# EAGLE design br-BM05B (EAGLE 9.4.2)
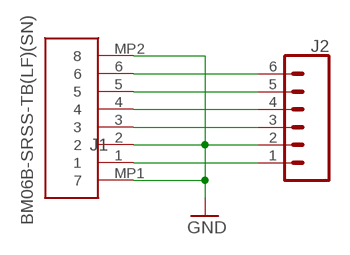
[diagram p0: schematic, sheet 1]

## Parts
J1  BM06B-SRSS-TB(LF)(SN)  [BM06BSRSSTBLFSN]
J2  CONN_06NO_SILK_FEMALE_PTH  [1X06_NO_SILK]

## Nets
GND: J1.2 J1.MP1 J1.MP2 J2.2
N$1: J1.1 J2.1
N$3: J1.3 J2.3
N$4: J1.4 J2.4
N$5: J1.5 J2.5
N$6: J1.6 J2.6

## Library data of the parts
J1 = 0SoK:BM06B-SRSS-TB(LF)(SN): connector,multipole PCB use,BM06B-SRSS-T JST SH Series, 1mm Pitch 6 Way 1 Row Straight PCB Header, Solder Termination, 1A Source: Datasheet <http://docs-emea.rs-online.com/webdocs/13ce/0900766b813ce45e.pdf>; DESCRIPTION: connector,multipole PCB use,BM06B-SRSS-T JST SH Series, 1mm Pitch 6 Way 1 Row Straight PCB Header, Solder Termination, 1A; HEIGHT: 4.25mm; MANUFACTURER_NAME: JST (JAPAN SOLDERLESS TERMINALS); MANUFACTURER_PART_NUMBER: BM06B-SRSS-TB(LF)(SN); RS_PART_NUMBER: 5468782; RS_PRICE-STOCK: https://uk.rs-online.com/web/p/products/5468782
J2 = SparkFun-Connectors:CONN_06: Multi connection point. Often used as Generic Header-pin footprint for 0.1 inch spaced/style header connections On any of the 0.1 inch spaced packages, you can populate with these: Break Away Headers - Straight <https://www.sparkfun.com/products/116> (PRT-00116) Break Away Male Headers - Right Angle <https://www.sparkfun.com/products/553> (PRT-00553) Female Headers <https://www.sparkfun.com/products/115> (PRT-00115) Break Away Headers - Machine Pin <https://www.sparkfun.com/products/117> (PRT-00117) Break Away Female Headers - Swiss Machine Pin <https://www.sparkfun.com/products/743> (PRT-00743) Arduino Stackable Header - 6 Pin <https://www.sparkfun.com/products/9280> (PRT-09280) For SCREWTERMINALS and SPRING TERMINALS visit here: Screw Terimnals on SparkFun.com <https://www.sparkfun.com/search/results?term=Screw+Terminals> (5mm/3.5mm/2.54mm spacing) This device is also useful as a general connection point to wire up your design to another part of your project. Our various solder wires solder well into these plated through hole pads. Hook-Up Wire - Assortment (Stranded, 22 AWG) <https://www.sparkfun.com/products/11375> (PRT-11375) Hook-Up Wire - Assortment (Solid Core, 22 AWG) <https://www.sparkfun.com/products/11367> (PRT-11367) View the entire wire category on our website here <https://www.sparkfun.com/categories/141>; PROD_ID: CONN-08437

## Board
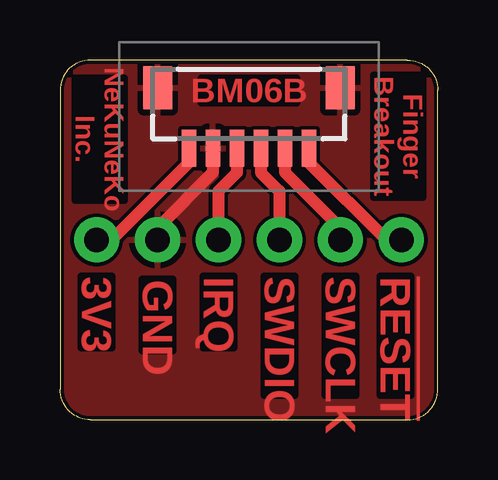
[diagram p1: board, top side]
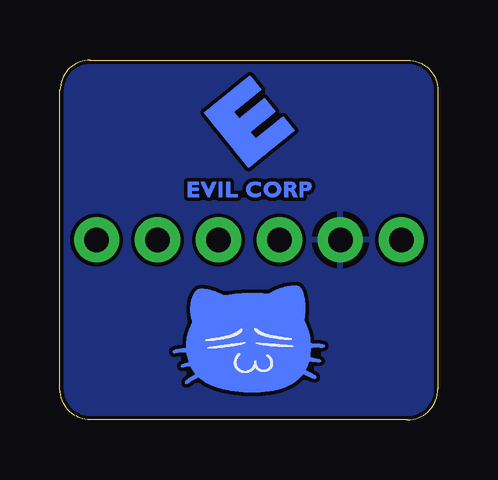
[diagram p2: board, bottom side, seen from below]

Size 15.75 x 14.99 mm. Coordinates in mm from the lower left corner, seen from the top.
Outline: 1.27,0 14.48,0 arc90 15.75,1.27 15.75,13.72 arc90 14.48,14.99 1.27,14.99 arc90 0,13.72 0,1.27 arc90 1.27,0
Copper layers (1*16): Top 0.035559375mm / dielectric 1.6mm / Bottom 0.035559375mm
Design rules "nekuneko": minimum track width 6mil, minimum drill 0.3mm, track to track 6mil, track to pad 6mil, pad to pad 6mil, via to via 6mil, smd to smd 6mil, copper to edge 6mil, drill to drill 6mil, minimum pad ring 5mil, minimum via ring 5mil, stop-mask expansion 2.5mil, vias tented up to drill 0mil, thermal gap 10mil

### Footprints (pad centres in the part's own frame; a part is rotated, then mirrored left to right if it is on the bottom)
BM06BSRSSTBLFSN = smd 0.6 x 1.55: 1 -2.5,-1.65; 2 -1.5,-1.65; 3 -0.5,-1.65; 4 0.5,-1.65; 5 1.5,-1.65; 6 2.5,-1.65 | smd 1.2 x 1.8: MP1 -3.8,0.875; MP2 3.8,0.875
1X06_NO_SILK = drill 1.016 pad 1.88: 1 0,0; 2 2.54,0; 3 5.08,0; 4 7.62,0; 5 10.16,0; 6 12.7,0

### Placement (x,y rotation side)
J1  7.87,12.95 0 top
J2  1.52,7.49 0 top
U$1  [NEKO_6_5_BORDE_SILK]  11.05,1.14 0 bottom
U$2  [ECORP_TSTOP_6]  11.18,8.76 0 bottom

### Tracks (layer width: path | path; a pad name or v marks a point on that pad's centre or on a via)
GND
  Top 0.508: J1.2 6.37,10.31 4.06,8 J2.2
  pour Top: 0,0 0,14.99 15.75,14.99 15.75,0
  pour Bottom: 0,0 15.75,0 15.75,14.99 0,14.99
N$1
  Top 0.508: J1.1 5.37,10.71 2.16,7.49 J2.1
N$3
  Top 0.508: J1.3 7.37,10.29 6.6,9.53 J2.3
N$4
  Top 0.508: J1.4 8.37,10.29 9.14,9.53 J2.4
N$5
  Top 0.508: J1.5 9.37,10.31 11.68,8 J2.5
N$6
  Top 0.508: J1.6 10.37,10.71 13.59,7.49 J2.6

### Text on the board
Top: BM06B | NeKuNeKo / Inc. | Finger / Breakout | 3V3 | GND | IRQ | SWDIO | SWCLK | !RESET
tStop: BM06B | NeKuNeKo / Inc. | Finger / Breakout | 3V3 | GND | IRQ | SWDIO | SWCLK | !RESET